# Altium schematic sheet PowerSupply.SchDoc
size A3; SheetNumber: 3; SheetTotal: 3; SPICEModelCacheLJVMQXJB: <root> / <DocumentId>LJVMQXJB</DocumentId> / </root>
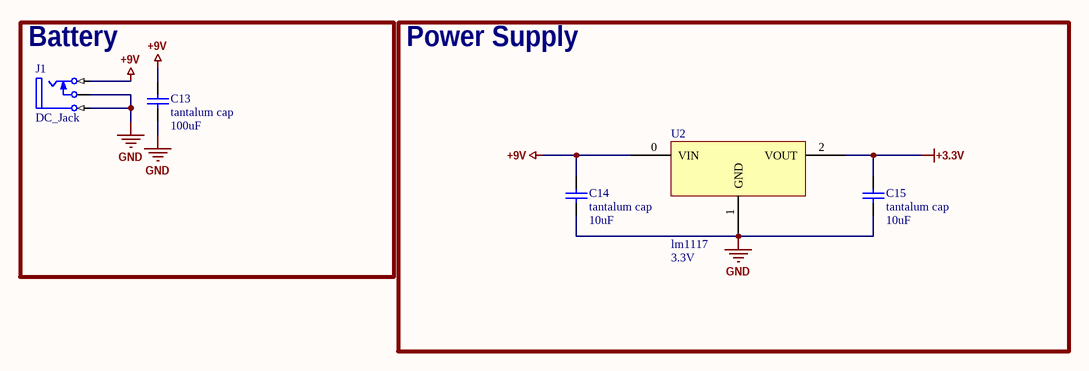
[diagram p0: PowerSupply.SchDoc]

## Parts
C13  tantalum cap  value 100uF  [C1206tancap]
C14  tantalum cap  value 10uF  [C1206tancap]
C15  tantalum cap  value 10uF  [C1206tancap]
J1  DC_Jack  [My_DC_Jack]
U2  lm1117  output voltag: 3.3V  [4-Pin SOT]

## Blocks framed on the sheet
Battery: C13 J1
Power Supply: C14 C15 U2

## Nets
+3.3V: C15.2 U2.2(VOUT)
+9V: C13.2 C14.2 J1.1(T) U2.0(VIN)
GND: C13.1 C14.1 C15.1 J1.2(TN) J1.3(S) U2.1(GND)

## Library data of the parts
C13 = Cap Semi_6: Capacitor (Semiconductor SIM Model); Published: 8-Jun-2000; LatestRevisionDate: 29-May-2009; LatestRevisionNote: IPC-7351 Footprint Added.; PackageReference: C1206; Publisher: Altium Limited; PackageDescription: Chip Capacitor
C14 C15 = Cap Semi_5: Capacitor (Semiconductor SIM Model); Published: 8-Jun-2000; LatestRevisionDate: 29-May-2009; LatestRevisionNote: IPC-7351 Footprint Added.; PackageReference: C1206; Publisher: Altium Limited; PackageDescription: Chip Capacitor
J1 = DC_Jack: ASiD Part Number: DC_Jack-AS
U2 = lm1117: The LM1117 is a low dropout voltage regulator with a / dropout of 1.2 V at 800 mA of load current. / The LM1117 is available in an adjustable version, / which can set the output voltage from 1.25 to 13.8 V / with only two external resistors. In addition, it is / available in five fixed voltages, 1.8 V, 2.5 V, 3.3 V, / and 5 V. / The LM1117 offers current limiting and thermal / shutdown. Its circuit includes a Zener trimmed / bandgap reference to assure output voltage accuracy / to within ±1%. / A minimum of 10-µF tantalum capacitor is required at / the output to improve the transient response and / stability.; ComponentLink1Description: datasheet; ComponentLink1URL: https://www.ti.com/lit/gpn/lm1117